# EAGLE design picsil Carrier (EAGLE 9.4.2)

## Sheet 1 of 3: Sensors and Boron
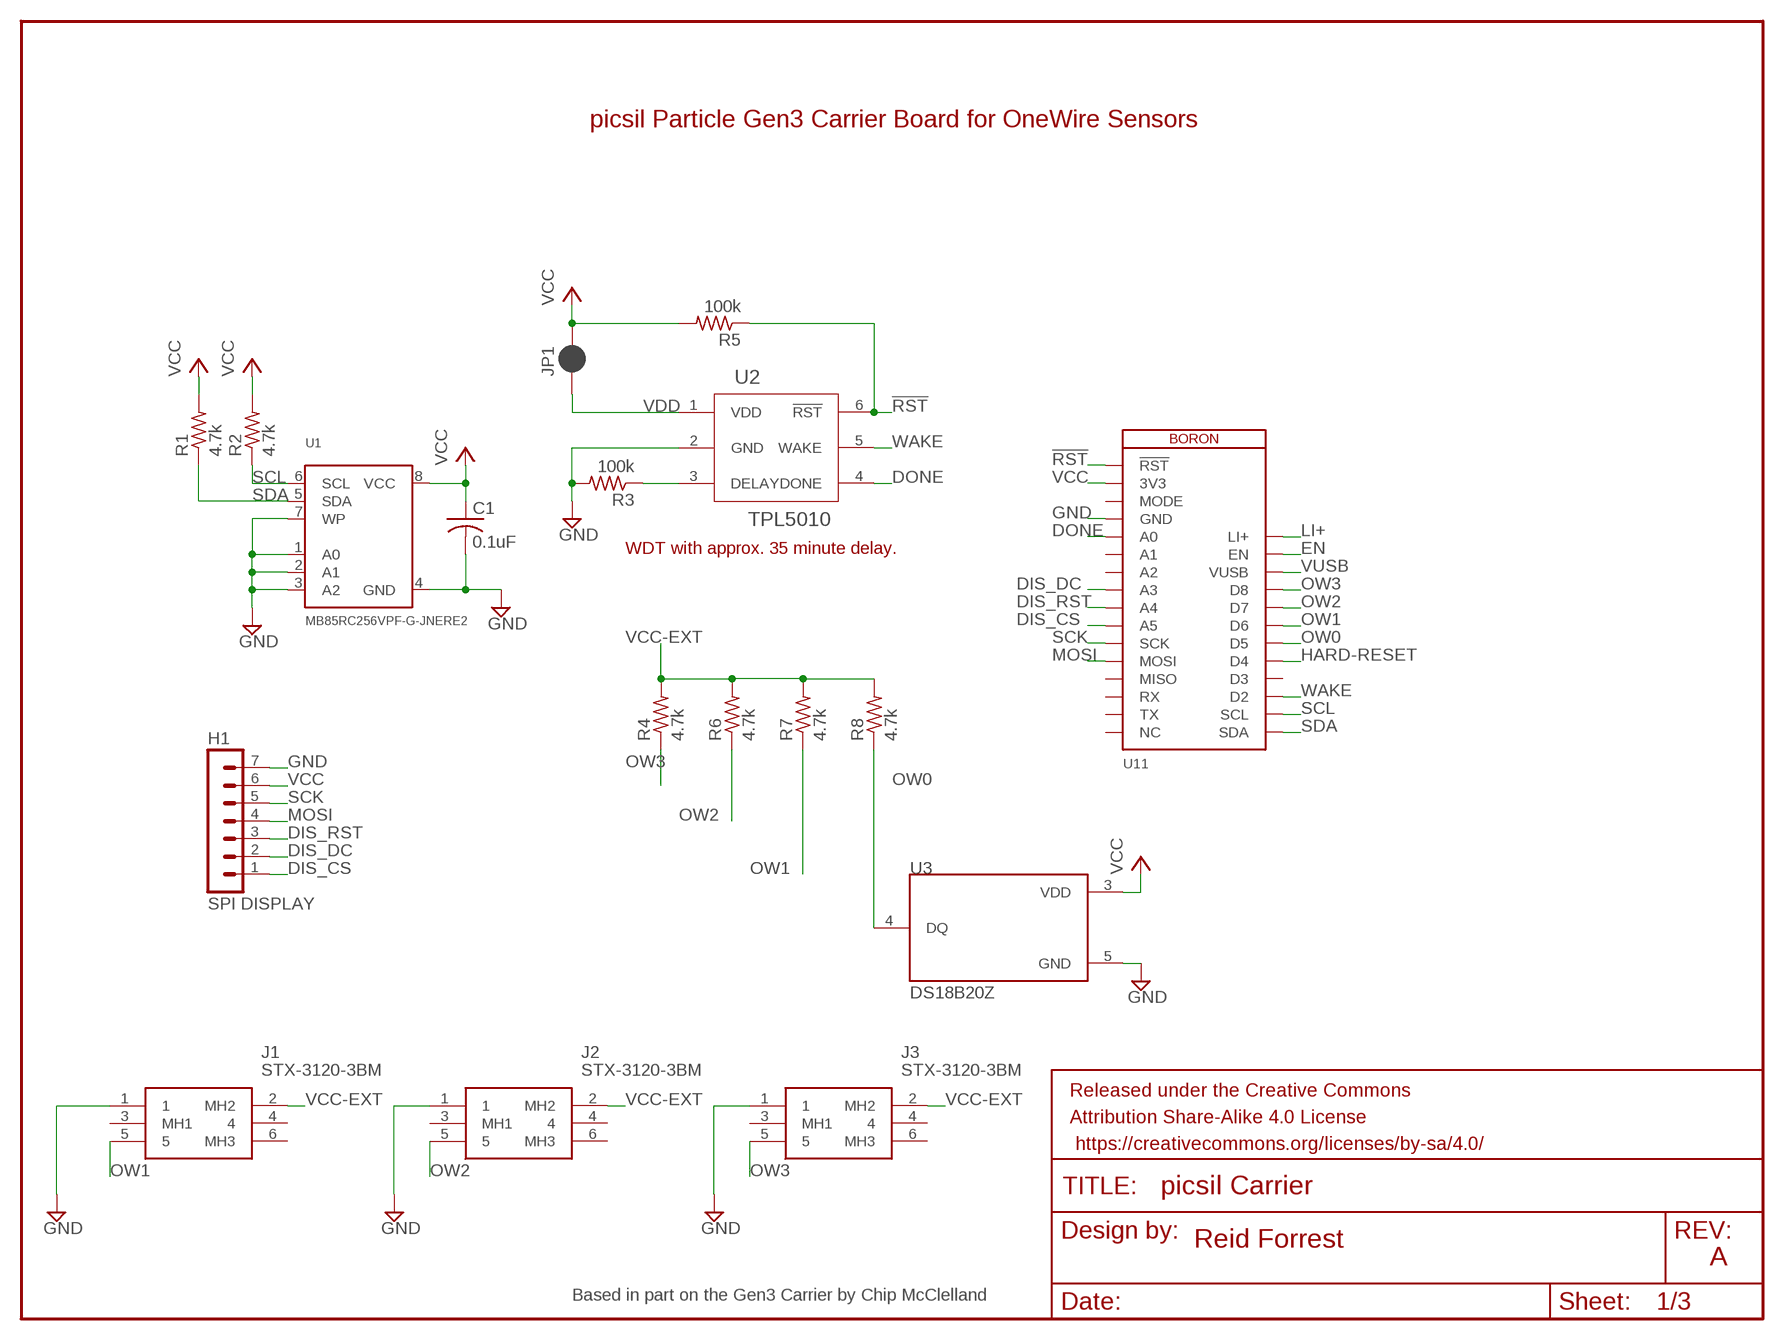
[diagram p0: schematic, sheet 1]

### Parts
C1  0.1uF  C-USC0805  [C0805]
FRAME1  FRAME-LETTER  [CREATIVE_COMMONS]
FRAME4  FRAME-LETTER  [CREATIVE_COMMONS]
H1  SPI DISPLAY  MA07-1  [MA07-1]
J1  STX-3120-3BM  [STX31203BM]
J2  STX-3120-3BM  [STX31203BM]
J3  STX-3120-3BM  [STX31203BM]
JP1  JUMPER-SMT_2_NC_PASTE_SILK  [SMT-JUMPER_2_NC_PASTE_SILK]
R1  4.7k  R-US_R0805  [R0805]
R2  4.7k  R-US_R0805  [R0805]
R3  100k  R-US_R0805  [R0805]
R4  4.7k  R-US_R0805  [R0805]
R5  100k  R-US_R0805  [R0805]
R6  4.7k  R-US_R0805  [R0805]
R7  4.7k  R-US_R0805  [R0805]
R8  4.7k  R-US_R0805  [R0805]
U1  MB85RC256VPF-G-JNERE2  FRAM_SOIC8_I2C  [SOIC8_208MIL]
U2  TPL5010  [TSOT-23]
U3  DS18B20Z  [SOIC127P600X175-8N]
U11  BORON  [BORON]

### Nets
!RST: R5.1 U2.6(!RST) U11.1(!RST)
DIS_CS: H1.1 U11.10(A5)
DIS_DC: H1.2 U11.8(A3)
DIS_RST: H1.3 U11.9(A4)
DONE: U2.4(DONE) U11.5(A0)
EN: U11.27(EN) ; also sheet 2
GND: C1.2 H1.7 J1.1 J2.1 J3.1 R3.2 U1.1(A0) U1.2(A1) U1.3(A2) U1.4(GND) U1.7(WP) U2.2(GND) U3.5(GND) U11.4(GND) ; also sheet 2,3
HARD-RESET: U11.21(D4) ; also sheet 2
LI+: U11.28(LI+) ; also sheet 2,3
MOSI: H1.4 U11.12(MOSI)
N$1: R3.1 U2.3(DELAY)
OW0: R8.1 U3.4(DQ) U11.22(D5)
OW1: J1.5 R7.1 U11.23(D6) ; also sheet 3
OW2: J2.5 R6.1 U11.24(D7) ; also sheet 3
OW3: J3.5 R4.1 U11.25(D8) ; also sheet 3
SCK: H1.5 U11.11(SCK)
SCL: R2.1 U1.6(SCL) U11.18(SCL)
SDA: R1.1 U1.5(SDA) U11.17(SDA)
VCC: C1.1 H1.6 JP1.2 R1.2 R2.2 R5.2 U1.8(VCC) U3.3(VDD) U11.2(3V3) ; also sheet 3
VCC-EXT: J1.2(MH2) J2.2(MH2) J3.2(MH2) R4.2 R6.2 R7.2 R8.2 ; also sheet 3
VDD: JP1.1 U2.1(VDD)
VUSB: U11.26(VUSB) ; also sheet 2,3
WAKE: U2.5(WAKE) U11.19(D2)
Unconnected: J1.3(MH1) J1.4 J1.6(MH3) J2.3(MH1) J2.4 J2.6(MH3) J3.3(MH1) J3.4 J3.6(MH3) U11.3(MODE) U11.6(A1) U11.7(A2) U11.13(MISO) U11.14(RX) U11.15(TX) U11.16(NC) U11.20(D3)

### Notes on the sheet
- picsil Particle Gen3 Carrier Board for OneWire Sensors
- WDT with approx. 35 minute delay.
- Reid Forrest
- A
- Based in part on the Gen3 Carrier by Chip McClelland

## Sheet 2 of 3: Power
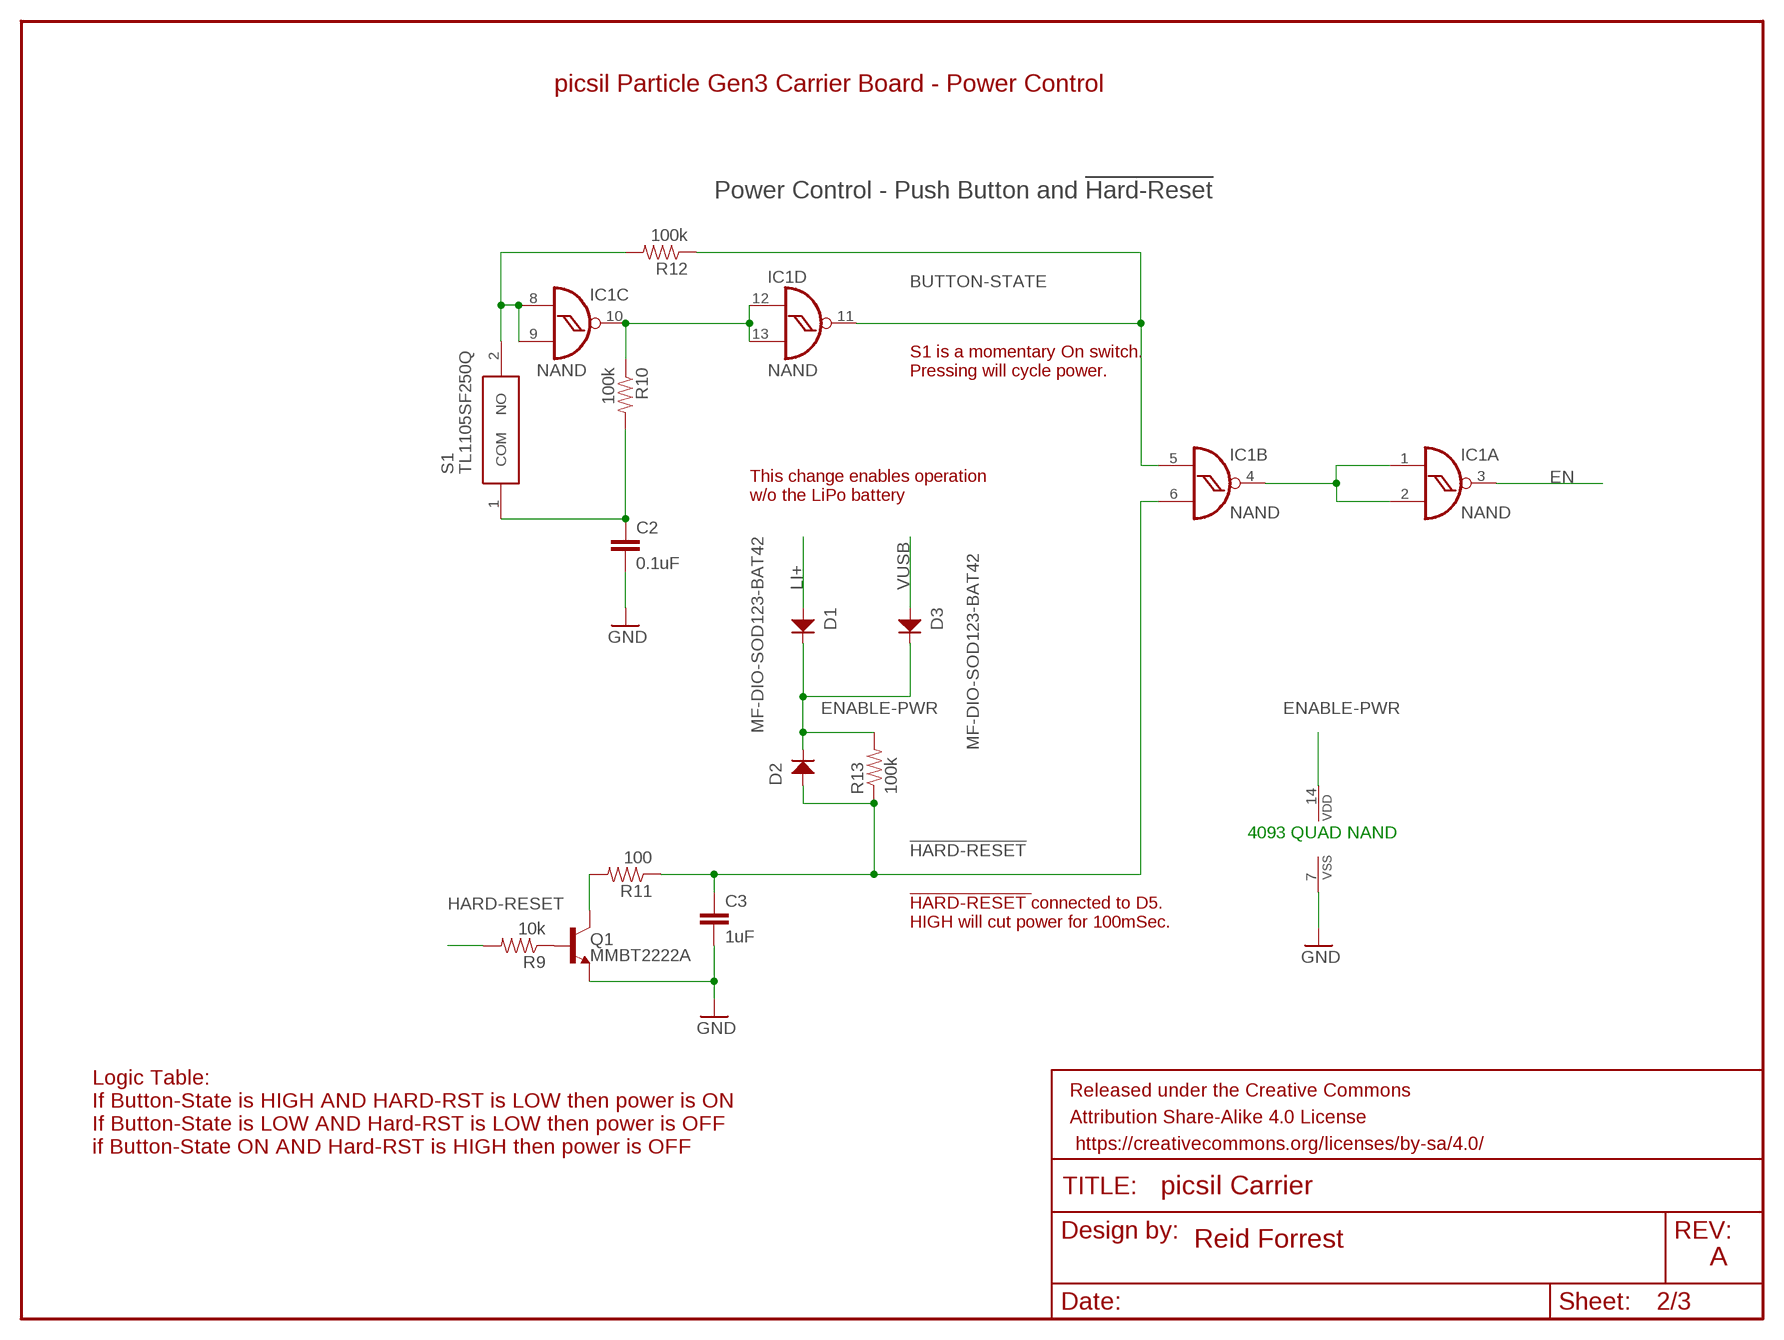
[diagram p1: schematic, sheet 2]

### Parts
C2  0.1uF  CAP0805  [0805@1]
C3  1uF  CAP0805  [0805@1]
D1  MF-DIO-SOD123-BAT42  DIODES_BAT42_SOD-123  [SOD-123]
D2  MF-DIO-SOD123-BAT42  DIODES_BAT42_SOD-123  [SOD-123]
D3  MF-DIO-SOD123-BAT42  DIODES_BAT42_SOD-123  [SOD-123]
FRAME2  FRAME-LETTER  [CREATIVE_COMMONS]
IC1  NAND  4093DT  [MC14093B-TSSOP14]
Q1  MMBT2222A  TRANS_NPN-MMBT2222AL  [SOT23-3]
R9  10k  RESISTOR0805-RES  [0805]
R10  100k  RESISTOR0805-RES  [0805]
R11  100  RESISTOR0805-RES  [0805]
R12  100k  RESISTOR0805-RES  [0805]
R13  100k  RESISTOR0805-RES  [0805]
S1  TL1105SF250Q  [TL1105SF250Q]

### Nets
!HARD-RESET: C3.1 D2.ANODE IC1.6(B:I1) R11.1 R13.1
BUTTON-STATE: IC1.5(B:I0) IC1.11(D:O) R12.1
EN: IC1.3(A:O) ; also sheet 1
ENABLE-PWR: D1.CATHODE D2.CATHODE D3.CATHODE IC1.14(P:VDD) R13.2
GND: C2.2 C3.2 IC1.7(P:VSS) Q1.2(E) ; also sheet 1,3
HARD-RESET: R9.2 ; also sheet 1
LI+: D1.ANODE ; also sheet 1,3
N$2: IC1.1(A:I0) IC1.2(A:I1) IC1.4(B:O)
N$14: IC1.10(C:O) IC1.12(D:I0) IC1.13(D:I1) R10.1
N$16: Q1.1(B) R9.1
N$19: Q1.3(C) R11.2
N$24: C2.1 R10.2 S1.1(COM)
N$25: IC1.8(C:I0) IC1.9(C:I1) R12.2 S1.2(NO)
VUSB: D3.ANODE ; also sheet 1,3

### Notes on the sheet
- picsil Particle Gen3 Carrier Board - Power Control
- Power Control - Push Button and !Hard-Reset
- S1 is a momentary On switch.
  Pressing will cycle power.
- This change enables operation 
  w/o the LiPo battery
- 4093 QUAD NAND
- !HARD-RESET !connected to D5. 
  HIGH will cut power for 100mSec.
- Logic Table:
  If Button-State is HIGH AND HARD-RST is LOW then power is ON
  If Button-State is LOW AND Hard-RST is LOW then power is OFF
  if Button-State ON AND Hard-RST is HIGH then power is OFF
- Reid Forrest
- A

## Sheet 3 of 3: Protection
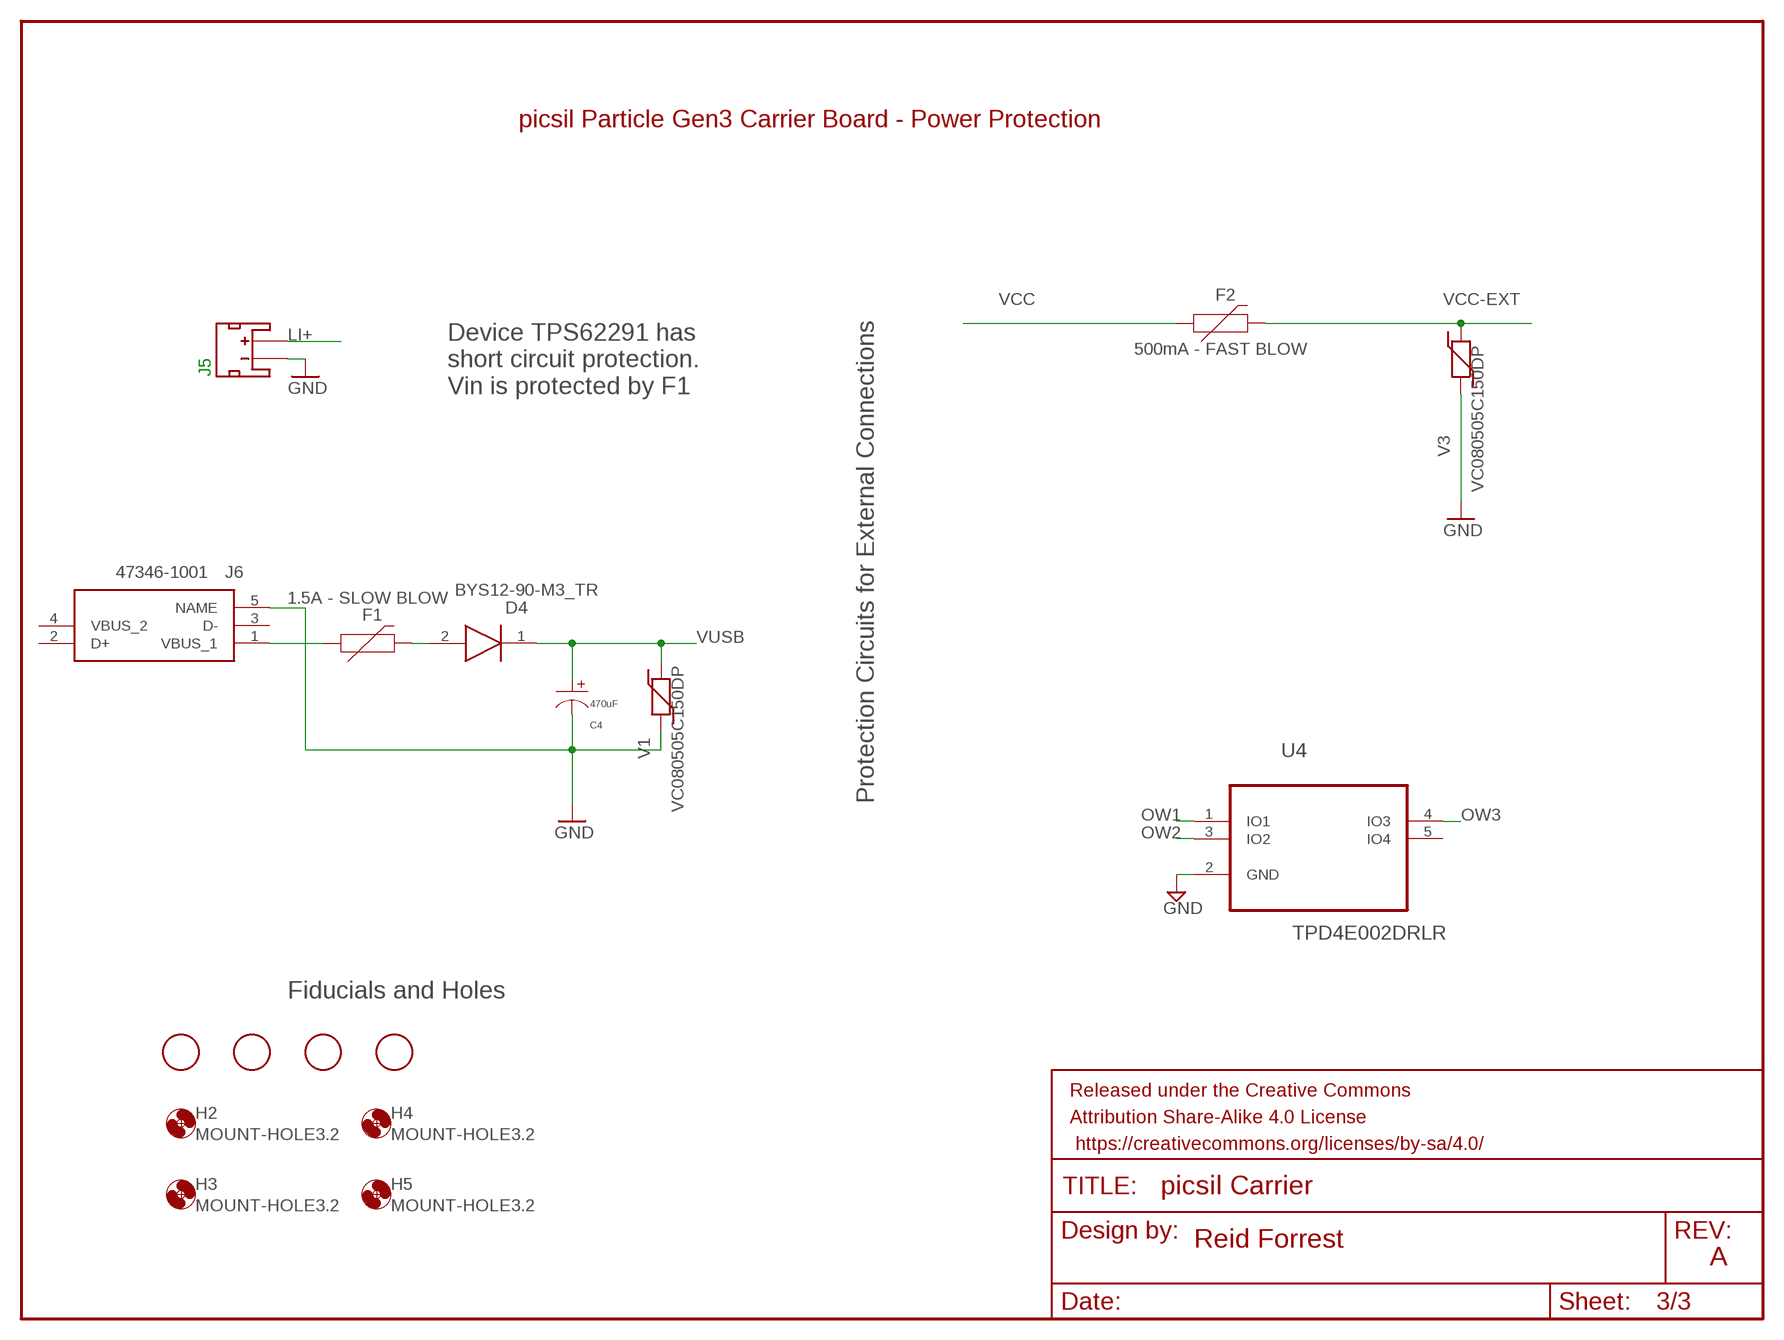
[diagram p2: schematic, sheet 3]

### Parts
C4  470uF  CAPACITOR_P_10MM  [CP10MM]
D4  BYS12-90-M3_TR  [DIOM5127X229N]
F1  1.5A - SLOW BLOW  PPTC_HALF-AMP  [1206]
F2  500mA - FAST BLOW  PPTC_HALF-AMP  [1206]
FRAME3  FRAME-LETTER  [CREATIVE_COMMONS]
H2  MOUNT-HOLE3.2  [3,2]
H3  MOUNT-HOLE3.2  [3,2]
H4  MOUNT-HOLE3.2  [3,2]
H5  MOUNT-HOLE3.2  [3,2]
J5  S2B-PH-SM4-TB(LF)(SN)  JST_2MM_MALE  [JST-2-SMD]
J6  47346-1001  [47346-0001]
U4  TPD4E002DRLR  [SOT50P280X60-5N]
U$1  FIDUCIAL  [FIDUCIAL_1MM]
U$2  FIDUCIAL  [FIDUCIAL_1MM]
U$3  FIDUCIAL  [FIDUCIAL_1MM]
U$4  FIDUCIAL  [FIDUCIAL_1MM]
V1  VC080505C150DP  VARISTOR  [0805]
V3  VC080505C150DP  VARISTOR  [0805]

### Nets
GND: C4.P$2 J5.1(-) J6.5(NAME) U4.2(GND) V1.1 V3.1 ; also sheet 1,2
LI+: J5.2(+) ; also sheet 1,2
N$3: F1.1 J6.1(VBUS_1)
N$4: D4.2(A) F1.2
OW1: U4.1(IO1) ; also sheet 1
OW2: U4.3(IO2) ; also sheet 1
OW3: U4.4(IO3) ; also sheet 1
VCC: F2.1 ; also sheet 1
VCC-EXT: F2.2 V3.2 ; also sheet 1
VUSB: C4.P$1 D4.1(K) V1.2 ; also sheet 1,2
Unconnected: J5.NC1(PAD1) J5.NC2(PAD2) J6.2(D+) J6.3(D-) J6.4(VBUS_2) U4.5(IO4)

### Notes on the sheet
- picsil Particle Gen3 Carrier Board - Power Protection
- Device TPS62291 has 
  short circuit protection. 
  Vin is protected by F1
- Protection Circuits for External Connections
- Fiducials and Holes
- Reid Forrest
- A

## Library data of the parts
C1 = adafruit:C-US: CAPACITOR, American symbol
C2 C3 = SparkFun-Capacitors:CAP: Capacitor Standard 0603 ceramic capacitor, and 0.1" leaded capacitor.
C4 = MF_Passives:CAPACITOR_P: Library: MF_Passives Description: Device for Polarized Capacitors. Manufacture part number (MPN), Voltage Rating, and Tolerance can be added via Attributes. Check https://factory.macrofab.com/parts for the house parts list.; POPULATE: 1
D1-D3 = MF_Discrete_Semiconductor:DIODES: Library: MF_Discrete_Semiconductor Description: Device for Single Packaged Diodes.; HOUSEPART: YES; MPN: MF-DIO-SOD123-BAT42; POPULATE: 1; URL: https://factory.macrofab.com/part/MF-DIO-SOD123-BAT42
D4 = SamacSys_Parts:BYS12-90-M3_TR: Schottky Diodes & Rectifiers 1A,90V,SM SCHOTTKY RECT. Source: Datasheet <http://www.vishay.com/docs/89412/bys12-90-m3.pdf>; DESCRIPTION: Schottky Diodes & Rectifiers 1A,90V,SM SCHOTTKY RECT.; HEIGHT: 2.29mm; MANUFACTURER_NAME: Vishay; MANUFACTURER_PART_NUMBER: BYS12-90-M3/TR; MOUSER_PART_NUMBER: 78-BYS12-90-M3TR; MOUSER_PRICE-STOCK: https://www.mouser.com/Search/Refine.aspx?Keyword=78-BYS12-90-M3TR
F1 F2 = SparkFun-Fuses:PPTC: Resettable Fuse PPTC Resettable Fuse. Really a sort of resistor with a polymeric positive temperature coefficient whose resistance increases dramatically with an increase in temperature. When heated by the power passing through the resistance rises causing the current to be limited, protecting the circuit. This is achieved by the transition of the polymer from a crystalline to an amorphous state where the conductive carbon separates breaking the conductive pathways found in the cool crystalline structure. When a PPTC cools back down it resumes conducting letting the circuit turn back on. SparkFun Products: SparkFun RedBoard - Programmed with Arduino <https://www.sparkfun.com/products/12757> Pro Micro - 5V/16MHz <https://www.sparkfun.com/products/12640> Arduino Pro 328 - 5V/16MHz <https://www.sparkfun.com/products/10915> MP3 Trigger <https://www.sparkfun.com/products/13720>; PROD_ID: RES-08585; VALUE: 6V/0.5A
FRAME1-FRAME4 = SparkFun-Aesthetics:FRAME-LETTER: Schematic Frame - Letter Standard 8.5x11 US Letter frame
H1 = con-lstb:MA07-1: PIN HEADER; OC_FARNELL: unknown; OC_NEWARK: unknown
H2-H5 = holes:MOUNT-HOLE: MOUNTING HOLE with drill center marker
IC1 = adafruit:4093: Quad 2-input NAND schmitt trigger
J1-J3 = SamacSys_Parts:STX-3120-3BM: Phone Connectors 3.5mm PCB MONO JACK 3P W/SWITCH BLACK Source: Datasheet <http://www.kycon.com/Pub_Eng_Draw/STX-3120-3BM.PDF>; DESCRIPTION: Phone Connectors 3.5mm PCB MONO JACK 3P W/SWITCH BLACK; HEIGHT: 10mm; MANUFACTURER_NAME: Kycon; MANUFACTURER_PART_NUMBER: STX-3120-3BM; MOUSER_PART_NUMBER: 806-STX-3120-3BM; MOUSER_PRICE-STOCK: https://www.mouser.com/Search/Refine.aspx?Keyword=806-STX-3120-3BM
J5 = SparkFun-Connectors:JST_2MM_MALE: JST 2MM MALE RA CONNECTOR Two pin, compact surface mount connector. Commonly used as a battery input connection point. We really like the solid locking feeling and high current rating on these small connectors. We use these all the time as battery connectors. Mates to single-cell LiPo batteries. Here is the connector we sell at SparkFun: JST Right Angle Connector - White <https://www.sparkfun.com/products/8612> (PRT-08612) Datasheet <http://www.sparkfun.com/datasheets/Prototyping/Connectors/JST-Horizontal.pdf> It was used on these SparkFun products: SparkFun MOSFET Power Controller <https://www.sparkfun.com/products/11214> (PRT-11214) SparkFun Battery Babysitter - LiPo Battery Manager <https://www.sparkfun.com/products/13777> (PRT-13777) And many, many others that required a lipo battery connection.; MFG: S2B-PH-SM4-TB(LF)(SN); PROD_ID: CONN-11443; SF_ID: PRT-08612
J6 = SamacSys_Parts:47346-1001: MOLEX - 47346-1001 - MULTIPOLE CONNECTOR Source: Datasheet <http://www.molex.com/webdocs/datasheets/pdf/en-us/0473461001_IO_CONNECTORS.pdf>; DESCRIPTION: MOLEX - 47346-1001 - MULTIPOLE CONNECTOR; HEIGHT: mm; MANUFACTURER_NAME: Molex; MANUFACTURER_PART_NUMBER: 47346-1001; MOUSER_PART_NUMBER: 538-47346-1001; MOUSER_PRICE-STOCK: https://www.mouser.com/Search/Refine.aspx?Keyword=538-47346-1001; RS_PART_NUMBER: 1788764; RS_PRICE-STOCK: http://uk.rs-online.com/web/p/products/1788764
JP1 = SparkFun-Jumpers:JUMPER-SMT_2_NC_PASTE: Normally closed solder jumper This jumper has an aperture in the stencil to allow solder paste to bridge the split in the wire so it's normally closed (NC). Wick off the solder to open the connection. Reapply solder to reclose the connection.
Q1 = SparkFun-DiscreteSemi:TRANS_NPN: NPN transistor Current controlled devices typically used to amplify current or used as a switch. BC547 - COM-08928 <http://www.sparkfun.com/products/8928> (TO-92 45V 100mA) (1.Collector 2.Base 3.Emitter) 2N3904 - COM-00521 <http://www.sparkfun.com/products/521> (TO-92 40V 200mA) (1.Emitter 2.Base 3.Collector) P2N2222A - COM-12852 <http://www.sparkfun.com/products/12852> (TO-92 40V 600mA) (1.Collector 2.Base 3.Emitter); PROD_ID: TRANS-08049; VALUE: 600mA/40V
R1-R8 = adafruit:R-US_: RESISTOR, American symbol
R9-R13 = SparkFun-Passives:RESISTOR: Resistor Basic schematic elements and footprints for 0603, 1206, and PTH resistors.
S1 = SamacSys_Parts:TL1105SF250Q: E-SWITCH - TL1105SF250Q - SWITCH, TACTILE SPST, 50mA, THROUGH HOLE Source: Datasheet <https://componentsearchengine.com/Datasheets/1/TL1105SF250Q.pdf>; DESCRIPTION: E-SWITCH - TL1105SF250Q - SWITCH, TACTILE SPST, 50mA, THROUGH HOLE; HEIGHT: mm; MANUFACTURER_NAME: E-Switch; MANUFACTURER_PART_NUMBER: TL1105SF250Q; MOUSER_PART_NUMBER: 612-TL1105S-250; MOUSER_PRICE-STOCK: https://www.mouser.com/Search/Refine.aspx?Keyword=612-TL1105S-250
U1 = microbuilder:FRAM_SOIC8_I2C: I2C FRAM - SOIC8 Package 256KBit (32Kx8) - MB85RC256VPF-G-JNERE2 - SOIC-8 200 Mil, 2.7-5.5V, -40°C-85°C
U2 = Custom Components:TPL5010: This is a TI Ultra-Low-Power External watchdog.
U3 = DS18B20Z:DS18B20Z: DALLAS - DALLAS DS18B20Z High-Precision 1-Wire Digital Thermometer; AVAILABILITY: Unavailable; DESCRIPTION: Temperature sensor; digital thermometer; -55÷120°C; SO8; MF: Maxim Integrated; MP: DS18B20Z+; PACKAGE: SOIC-8 Maxim; PRICE: None
U4 = TPD4E002DRLR:TPD4E002DRLR: QUAD LOW-CAPACITANCE ARRAY WITH ±15-kV ESD PROTECTION; AVAILABILITY: Unavailable; DESCRIPTION: Quad Low-Capacitance Array With +/-15-kV ESD Protection 5-SOT -40 to 85; MF: Texas Instruments; MP: TPD4E002DRLR; PACKAGE: SOT-553 Texas Instruments; PRICE: None
U11 = Particle-Devices:BORON: BORON The Particle Boron cellular enabled development kit that can act as either a standalone cellular device or LTE enabled gateway, repeater, or endpoint for a Particle Mesh networks. More information: https://docs.particle.io/boron/ Footprint and formfactor based on Adafruit Feather. <https://www.adafruit.com/feather>
U$1-U$4 = adafruit:FIDUCIAL: For use by pick and place machines to calibrate the vision/machine, 1mm By microbuilder.eu
V1 V3 = Custom Components:VARISTOR

## Net classes
0 default: width 0.203 mm, drill 0.33 mm

## Board
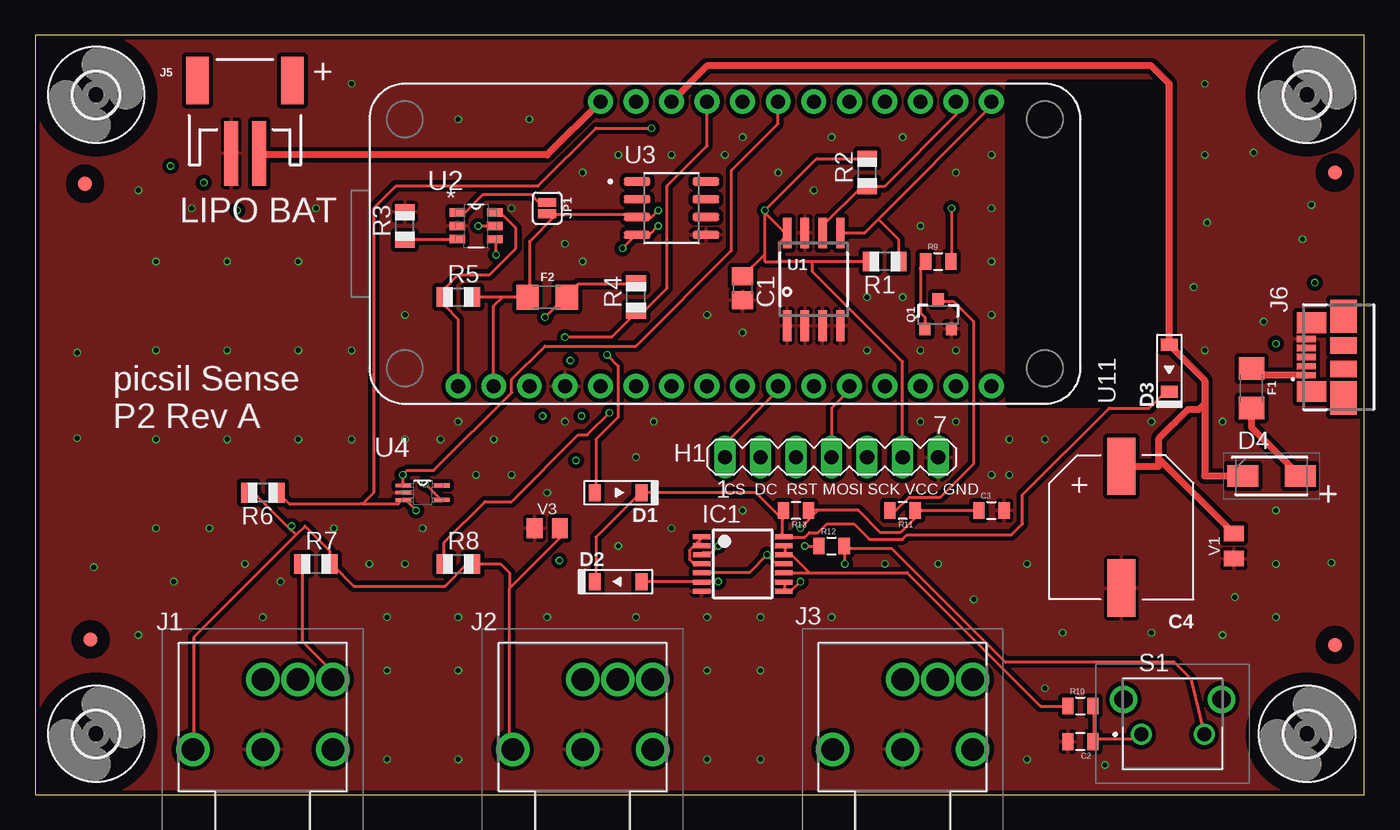
[diagram p3: board, top side]
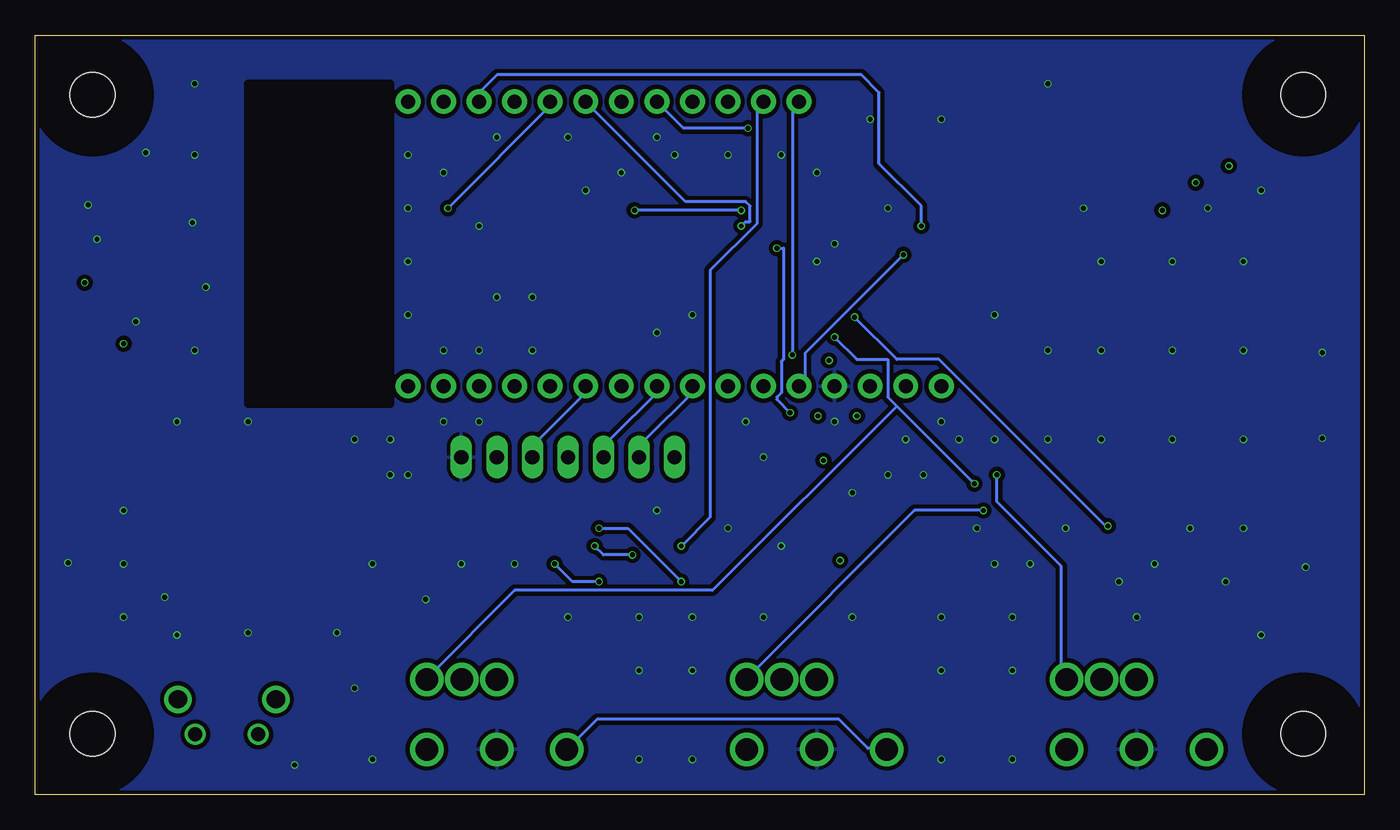
[diagram p4: board, bottom side, seen from below]

Size 94.99 x 54.28 mm. Coordinates in mm from the lower left corner, seen from the top.
Outline: 0,0 94.99,0 94.99,54.28 0,54.28 0,0
Copper layers (1*16): Top 0.035559375mm / dielectric 1.6mm / Bottom 0.035559375mm
Design rules "jlcpcb2layer": minimum track width 5mil, minimum drill 12mil, track to track 5mil, track to pad 5mil, pad to pad 5mil, via to via 5mil, smd to smd 5mil, copper to edge 8mil, drill to drill 6mil, minimum pad ring 5mil, minimum via ring 3mil, stop-mask expansion 2.5mil, vias tented up to drill 0mil, thermal gap 10mil

### Footprints (pad centres in the part's own frame; a part is rotated, then mirrored left to right if it is on the bottom)
C0805 = smd 1.3 x 1.5: 1 -0.85,0; 2 0.85,0
0805@1 = smd 0.8 x 1.2: 1 -0.9,0; 2 0.9,0
CP10MM = smd 2 x 4.1: P$1 0,-4.35; P$2 0,4.35
SOD-123 = smd 0.85 x 1.2: ANODE 1.675,0; CATHODE -1.675,0
DIOM5127X229N = smd 2.2 x 1.55: 1 -2.05,0; 2 2.05,0
1206 = smd 1.6 x 1.8: 1 -1.4,0; 2 1.4,0
MA07-1 = drill 1.016 long: 1 -7.62,0; 2 -5.08,0; 3 -2.54,0; 4 0,0; 5 2.54,0; 6 5.08,0; 7 7.62,0
3,2 = hole 3.2: 0,0
MC14093B-TSSOP14 = smd 0.36 x 1.26: 1 -1.95,-2.925; 2 -1.3,-2.925; 3 -0.65,-2.925; 4 0,-2.925; 5 0.65,-2.925; 6 1.3,-2.925; 7 1.95,-2.925; 8 1.95,2.925; 9 1.3,2.925; 10 0.65,2.925; 11 0,2.925; 12 -0.65,2.925; 13 -1.3,2.925; 14 -1.95,2.925
STX31203BM = drill 1.6 pad 2.35: 1 -0.55,0; 2 -0.55,5; 3 4.45,0; 4 4.45,-2.5; 5 4.45,-5; 6 -0.55,-5
JST-2-SMD = smd 1 x 4.6: 1 -1,-3.7; 2 1,-3.7 | smd 1.6 x 3.4: NC1 -3.4,1.5; NC2 3.4,1.5
47346-0001 = smd 0.45 x 1.38: 1 1.3,-4.81; 2 0.65,-4.81; 3 0,-4.81; 4 -0.65,-4.81; 5 -1.3,-4.81 | smd 1.475 x 2.1: 6 -2.453,-4.45; 7 2.453,-4.45 | smd 1.175 x 1.9: 8 0.838,-2.15; 9 -0.838,-2.15 | smd 2.375 x 1.9: 10 2.913,-2.15; 11 -2.913,-2.15
SMT-JUMPER_2_NC_PASTE_SILK = smd 0.635 x 1.27: 1 -0.406,0; 2 0.406,0
SOT23-3 = smd 0.8 x 0.9: 1 -0.95,-1; 2 0.95,-1; 3 0,1.1
R0805 = smd 1.1 x 1.4: 1 -1,0; 2 1,0
0805 = smd 0.8 x 1.2: 1 -0.9,0; 2 0.9,0
TL1105SF250Q = drill 1 pad 1.5: 1 -2.25,-0.75; 2 2.25,-0.75 | drill 1.3 pad 1.95: 3 3.5,1.75; 4 -3.5,1.75
SOIC8_208MIL = smd 0.6 x 2.2: 1 -1.905,-3.315; 2 -0.635,-3.315; 3 0.635,-3.315; 4 1.905,-3.315; 5 1.905,3.315; 6 0.635,3.315; 7 -0.635,3.315; 8 -1.905,3.315
TSOT-23 = smd 1.1 x 0.6: 1 -1.35,0.95; 2 -1.35,0; 3 -1.35,-0.94; 4 1.35,-0.95; 5 1.35,0; 6 1.35,0.95
SOIC127P600X175-8N = smd 1.9 x 0.6: 1 -2.455,1.905; 2 -2.455,0.635; 3 -2.455,-0.635; 4 -2.455,-1.905; 5 2.455,-1.905; 6 2.455,-0.635; 7 2.455,0.635; 8 2.455,1.905
SOT50P280X60-5N = smd 1.118 x 0.254: 1 -1.372,0.508; 2 -1.372,0; 3 -1.372,-0.508 | smd 1.118 x 0.305: 4 1.372,-0.508; 5 1.372,0.508
BORON = drill 1 pad 1.778: 1 1.27,44.45; 2 1.27,41.91; 3 1.27,39.37; 4 1.27,36.83; 5 1.27,34.29; 6 1.27,31.75; 7 1.27,29.21; 8 1.27,26.67; 9 1.27,24.13; 10 1.27,21.59; 11 1.27,19.05; 12 1.27,16.51; 13 1.27,13.97; 14 1.27,11.43; 15 1.27,8.89; 16 1.27,6.35; 17 21.59,6.35; 18 21.59,8.89; 19 21.59,11.43; 20 21.59,13.97; 21 21.59,16.51; 22 21.59,19.05; 23 21.59,21.59; 24 21.59,24.13; 25 21.59,26.67; 26 21.59,29.21; 27 21.59,31.75; 28 21.59,34.29
FIDUCIAL_1MM = smd 1 x 1: 1 0,0
0805' = smd 1.118 x 1.448: 1 -0.902,0; 2 0.902,0

### Placement (x,y rotation side)
C1  50.56,36.2 270 top
C2  74.69,3.81 180 top
C3  68.34,20.32 0 top
C4  77.63,19.13 180 top
D1  41.67,21.59 180 top
D2  41.67,15.24 0 top
D3  81.04,30.48 90 top
D4  88.34,22.78 0 top
F1  86.92,29.05 270 top
F2  36.59,35.56 0 top
FRAME1  -69.85,-12.3 0 top  (outside the outline)
FRAME2  -70.09,25.4 0 top  (outside the outline)
FRAME3  -68.82,35.56 0 top  (outside the outline)
FRAME4  -69.85,-21.03 0 top  (outside the outline)
H1  56.91,24.13 0 top
H2  90.88,50.01 0 top
H3  4.37,4.37 0 top
H4  4.37,50.01 0 top
H5  90.88,4.37 0 top
IC1  50.56,16.51 270 top
J1  16.27,3.81 90 top
J2  39.13,3.81 90 top
J3  61.99,3.81 90 top
J5  15,49.53 0 top
J6  95.65,31.27 270 top
JP1  36.59,41.91 270 top
Q1  64.53,34.29 0 top
R1  60.72,38.1 180 top
R2  59.45,44.45 90 top
R3  26.43,40.64 90 top
R4  42.94,35.56 90 top
R5  30.24,35.56 0 top
R6  16.27,21.59 180 top
R7  20.08,16.51 0 top
R8  30.24,16.51 0 top
R9  64.53,38.1 0 top
R10  74.69,6.35 0 top
R11  61.99,20.32 180 top
R12  56.91,17.78 0 top
R13  54.37,20.32 180 top
S1  81.28,5.08 0 top
U1  55.64,36.83 0 top
U2  31.51,40.64 0 top
U3  45.48,41.91 0 top
U4  27.7,21.59 0 top
U11  74.69,27.94 90 top
U$1  3.57,43.66 0 top
U$2  92.87,10.72 0 top
U$3  92.87,44.45 0 top
U$4  3.97,11.11 0 top
V1  VC080505C150DP  [0805']  85.65,17.78 90 top
V3  VC080505C150DP  [0805']  36.59,19.05 0 top

### Tracks (layer width: path | path; a pad name or v marks a point on that pad's centre or on a via)
!HARD-RESET  (via drill 0.35)
  Top 0.203: D2.ANODE 47.55,15.24 IC1.6 47.7,15.24 v48.82,15.24 | 55.96,20.32 58.82,20.32 60.4,18.73 61.83,18.73 62.79,19.68 62.79,20.32 R11.1 C3.1 | 55.96,20.32 R13.1 | 55.96,20.32 v54.69,19.05
  Bottom 0.203: v48.82,15.24 52.63,19.05 v54.69,19.05
!RST
  Top 0.203: 29.29,35.56 29.29,36.2 30.24,37.15 32.46,37.15 34.37,39.05 34.37,40.48 33.42,41.43 32.94,41.43 U2.6 | U11.1 30.24,33.97 29.29,34.92 29.29,35.56 | 29.29,35.56 R5.1
BUTTON-STATE  (via drill 0.35)
  Top 0.203: v55.01,17.78 R12.1 | IC1.11 52.94,16.51 v52.31,17.14 51.04,15.88 47.7,15.88 IC1.5
  Bottom 0.203: v55.01,17.78 54.37,17.14 v52.31,17.14
DIS_CS
  Top 0.203: H1.1 49.29,25.08 53.1,28.89 U11.10
DIS_DC
  Bottom 0.203: H1.2 51.83,25.4 51.36,25.4 48.02,28.73 U11.8
DIS_RST
  Bottom 0.203: H1.3 54.37,25.4 53.9,25.4 50.56,28.73 U11.9
DONE  (via drill 0.35)
  Top 0.203: v32.94,38.58 32.94,39.69 U2.4
  Bottom 0.203: v32.94,38.58 39.93,31.59 39.93,29.21 U11.5
EN  (via drill 0.35)
  Top 0.203: v48.82,17.78 48.34,17.3 47.7,17.3 IC1.3
  Bottom 0.203: v48.82,17.78 46.75,19.84 46.75,37.47 43.42,40.8 43.42,49.53 U11.27
ENABLE-PWR
  Top 0.203: D2.CATHODE 40.08,15.24 40.08,18.41 43.26,21.59 D1.CATHODE 51.51,21.59 53.42,19.68 | 53.42,19.68 53.42,18.57 IC1.14 53.58,18.41 55.01,18.41 55.32,18.73 55.96,18.73 56.59,19.37 58.5,19.37 59.61,18.26 61.99,18.26 62.31,18.57 69.77,18.57 70.56,19.37 70.56,21.43 76.76,27.62 79.61,27.62 80.72,28.73 81.04,28.73 D3.CATHODE | 53.42,19.68 53.42,20.32 R13.2
GND  (via drill 0.35)
  other vias: 55.64,43.18 64.53,16.51 70.88,16.51 68.34,22.86 69.61,22.86 56.91,46.99 53.1,44.45 61.99,46.99 68.34,45.72 65.8,44.45 68.34,41.91 68.34,38.1 68.34,34.29 63.26,40.64 61.99,35.56 83.58,50.8 83.58,45.72 87.07,45.88 83.58,31.75 87.79,33.81 91.2,42.15 90.57,39.69 84.85,26.67 72.15,25.4 69.61,25.4 65.8,26.67 63.26,26.67 65.8,31.75 63.26,31.75 82.79,36.27 83.74,40.88 92.63,16.59 88.66,20.32 88.66,16.51 88.66,12.7 84.85,11.43 79.77,11.59 73.42,11.59 67.07,13.97 3.02,25.48 72.15,7.62 70.88,2.54 76.44,2.14 48.02,34.29 50.56,33.02 59.45,31.75 44.21,26.67 42.94,24.13 45.48,19.05 41.67,17.78 48.02,12.7 51.83,12.7 56.91,12.7 51.83,8.89 48.02,8.89 48.02,2.54 51.83,2.54 42.94,12.7 36.59,12.7 36.59,21.59 37.86,26.67 32.78,25.4 34.05,22.86 31.51,22.86 27.7,19.05 23.89,16.51 26.43,16.51 30.24,26.67 26.43,25.4 28.97,25.4 25.16,12.7 30.24,12.7 25.16,8.89 30.24,8.89 25.16,2.54 30.24,2.54 16.27,12.7 17.54,15.24 9.92,15.24 15,16.51 12.46,19.05 8.65,19.05 8.65,25.4 13.73,25.4 18.81,25.4 22.62,25.4 22.62,31.75 18.81,31.75 13.73,31.75 8.65,31.75 8.65,38.1 13.73,38.1 18.81,38.1 20.08,41.91 11.19,41.91 7.38,43.18 3.02,31.59 22.62,50.8 50.56,46.99 45.48,45.72 39.13,44.45 41.67,45.72 49.29,45.72 50.56,20.32 21.35,19.05 59.45,35.56 37.86,39.37 39.13,38.1 34.05,41.91 79.77,26.67 60.72,16.51 30.24,48.26 35.32,48.26 26.43,34.29 7.38,11.43 4.21,16.27 85.73,14.13
  pour Bottom (isolate 0.305): -1.43,-0.64 96.28,-0.64 96.28,54.85 -1.43,54.85
  pour Top (isolate 0.305): -3.1,-1.27 97.55,-1.27 97.55,55.48 -3.1,55.48
GND1  (via drill 0.35)
  other vias: 38.26,31.04
GND2  (via drill 0.35)
  other vias: 36.27,27.07
GND3  (via drill 0.35)
  other vias: 12.06,43.74
GND4  (via drill 0.35)
  other vias: 14.45,41.75
GND5  (via drill 0.35)
  other vias: 9.68,44.93
GND6  (via drill 0.35)
  other vias: 39.05,27.07
GND7  (via drill 0.35)
  other vias: 38.66,23.89
GND8  (via drill 0.35)
  other vias: 37.46,16.75
GND9  (via drill 0.35)
  other vias: 91.44,36.59
GND10  (via drill 0.35)
  other vias: 88.66,32.23
HARD-RESET  (via drill 0.35)
  Top 0.203: v65.48,41.91 65.48,38.1 R9.2
  Bottom 0.203: v65.48,41.91 58.18,49.21 U11.21
LI+  (via drill 0.35)
  Top 0.203: v40.88,31.43 41.67,30.64 41.67,26.99 40.08,25.4 40.08,21.59 D1.ANODE
  Top 0.508: U11.28 36.59,45.72 16.11,45.72 J5.2
  Bottom 0.203: v40.88,31.43 40.88,49.53 U11.28
MOSI
  Top 0.203: H1.4 56.91,27.62 58.18,28.89 U11.12
N$1
  Top 0.203: U2.3 30.08,39.69 26.43,39.69 R3.1
N$2
  Top 0.203: IC1.4 47.07,16.51 46.75,16.83 46.75,17.46 47.39,18.1 | 47.39,18.1 47.7,18.41 IC1.1 | 47.39,18.1 47.55,17.94 IC1.2
N$3
  Top 0.508: J6.1 87.39,29.97 F1.1
N$4
  Top 0.508: D4.2 86.92,26.26 F1.2
N$14
  Top 0.203: IC1.13 53.58,17.78 53.58,17.3 IC1.12 53.58,17.14 54.05,17.14 55.32,15.88 | R10.1 71.83,6.35 62.31,15.88 55.32,15.88 | 55.32,15.88 53.58,15.88 IC1.10
N$16
  Top 0.203: Q1.1 63.58,33.34 63.58,34.13 63.26,34.45 63.26,37.62 63.74,38.1 R9.1
N$19
  Top 0.203: R11.2 61.52,20.32 62.47,21.27 64.69,21.27 67.07,23.65 67.07,33.81 65.64,35.24 64.53,35.24 Q1.3
N$24
  Top 0.203: 75.64,3.97 75.64,6.4 R10.2 | 75.64,3.97 75.64,3.81 C2.1 75.64,3.97 | 75.64,3.97 78.91,3.97 S1.1
N$25  (via drill 0.35)
  Top 0.203: v57.86,16.51 57.86,17.62 | 57.86,17.62 57.86,17.78 R12.2 57.86,17.62 | v54.69,15.24 54.05,14.61 53.58,14.61 | 53.58,14.61 53.58,15.08 IC1.9 | 53.58,14.61 IC1.8 | 57.86,17.62 61.2,17.62 69.29,9.53 81.36,9.53 82.58,8.3 S1.2
  Bottom 0.203: v57.86,16.51 56.59,15.24 v54.69,15.24
OW0  (via drill 0.35)
  Top 0.203: v41.04,27.3 39.45,25.72 38.81,25.72 34.05,20.95 32.15,20.95 29.24,18.05 R8.1 | v41.99,39.05 42.94,40.01 U3.4 43.89,40.01 v44.53,40.64
  Bottom 0.203: v41.04,27.3 41.99,28.26 41.99,28.42 41.67,28.73 41.67,30.96 41.51,31.11 41.51,39.05 v41.99,39.05 | U11.22 48.5,42.39 44.21,42.39 43.89,42.07 43.89,40.96 44.21,40.96 v44.53,40.64
OW1  (via drill 0.35)
  Top 0.203: U4.1 26.27,22.07 v26.27,22.86 26.59,23.18 28.5,23.18 34.05,28.73 34.05,29.69 36.43,32.07 42.94,32.07 49.77,38.89 49.77,44.61 53.1,47.94 U11.23 | R7.1 19.13,16.51 19.13,10.95 21.19,8.89 21.19,8.41 J1.5
  Bottom 0.203: v26.27,22.86 26.27,20.95 21.67,16.35 21.67,8.41 21.35,8.41 J1.5
OW2  (via drill 0.35)
  Top 0.203: 23.42,20.8 25.96,20.8 26.27,21.11 U4.3 26.43,21.11 v27.23,20.32 | R6.1 17.38,21.59 18.18,20.8 23.26,20.8 23.42,20.8 | v44.05,47.62 40.08,47.62 35.96,43.5 25.8,43.5 24.21,41.91 24.21,21.59 23.42,20.8
  Bottom 0.203: U11.24 48.66,47.62 v44.05,47.62 | v27.23,20.32 32.15,20.32 44.05,8.41 J2.5
OW3  (via drill 0.35)
  Top 0.203: v27.86,22.23 28.97,21.11 U4.4 | v37.86,32.7 41.2,32.7 42.94,34.45 R4.1 42.94,34.61 43.58,34.61 45.16,36.2 45.16,43.5 48.02,46.35 U11.25
  Bottom 0.203: 33.42,27.78 34.05,28.42 34.05,31.11 36.27,31.11 v37.86,32.7 | 33.42,27.78 v27.86,22.23 | 33.42,27.78 46.59,14.61 60.72,14.61 66.91,8.41 J3.5
SCK
  Bottom 0.203: H1.5 59.45,25.4 58.98,25.4 55.64,28.73 U11.11
SCL
  Top 0.203: U1.6 56.28,40.64 59.09,43.45 R2.1 60.67,43.45 65.8,48.58 U11.18
SDA
  Top 0.203: U11.17 68.34,49.21 60.25,41.12 | 60.25,41.12 59.29,40.16 57.55,40.16 U1.5 | R1.1 61.72,39.64 60.25,41.12
VCC  (via drill 0.35)
  Top 0.203: v52.15,41.75 52.15,41.59 53.74,40.01 | 52.15,38.63 52.15,38.1 53.18,38.1 | 52.15,38.63 v52.15,41.75 | R1.2 55.56,38.1 | 55.56,38.1 53.18,38.1 | 33.42,35.56 F2.1 35.32,35.56 35.32,39.53 37.23,41.43 | 33.42,35.56 R5.2 | 37.23,41.43 42.78,41.43 42.94,41.27 U3.3 44.05,41.27 v44.53,41.75 | 37.23,41.43 36.59,41.43 JP1.2 | H1.6 61.99,30.96 55.56,37.39 55.56,38.1 | v52.15,41.75 55.85,45.45 R2.2 | C1.1 52.15,38.63 | 33.42,35.56 32.78,34.92 U11.2 | 53.74,40.01 53.18,39.45 53.18,38.1 | U1.8 53.74,40.01
  Bottom 0.203: v44.53,41.75 v52.15,41.75
VCC-EXT  (via drill 0.35)
  Top 0.203: 33.89,14.76 37.54,18.41 37.54,19.05 V3.2 | 33.89,14.76 33.89,14.61 33.89,3.49 34.05,3.33 J2.2 | 37.86,35.56 38.81,36.51 42.94,36.51 R4.2 | 18.18,19.05 15.64,21.59 R6.2 | 18.18,19.05 18.65,18.57 | v36.43,34.13 37.86,35.56 | 18.18,19.05 v18.34,19.21 | 37.86,35.56 F2.2 | 18.65,18.57 19.29,19.21 21.08,17.41 R7.2 21.19,16.51 22.78,14.92 29.29,14.92 30.88,16.51 R8.2 33.26,16.51 33.89,15.88 33.89,14.76 | 18.65,18.57 11.35,11.27 11.35,3.33 J1.2
  Bottom 0.203: J3.2 56.91,3.33 54.85,5.4 37.54,5.4 35.48,3.33 34.21,3.33 J2.2 | v36.43,34.13 33.42,31.11 30.4,31.11 18.49,19.21 v18.34,19.21
VDD
  Top 0.203: U2.1 30.24,41.59 30.72,41.59 31.99,42.86 35.48,42.86 35.96,42.39 36.59,42.39 JP1.1
VUSB
  Top 0.508: 83.58,27.94 83.58,29.61 D3.ANODE 81.04,50.8 79.77,52.07 48.02,52.07 U11.26 | 83.58,27.94 83.58,22.78 D4.1 | 83.58,27.94 83.18,27.54 82.39,27.54 80.31,25.46 80.31,24.02 | C4.P$1 80.31,23.48 80.31,24.02 | V1.2 80.31,24.02
WAKE  (via drill 0.35)
  Top 0.203: v31.67,40.64 U2.5
  Bottom 0.203: v31.67,40.64 31.67,42.07 34.69,45.09 34.69,50.16 35.96,51.44 61.99,51.44 63.26,50.16 U11.19

### Text on the board
tNames: + | LIPO BAT | picsil Sense / P2 Rev A | CS DC RST MOSI SCK VCC GND | +